# EAGLE design Interconnect_board_v1p7 (EAGLE 9.3.1)
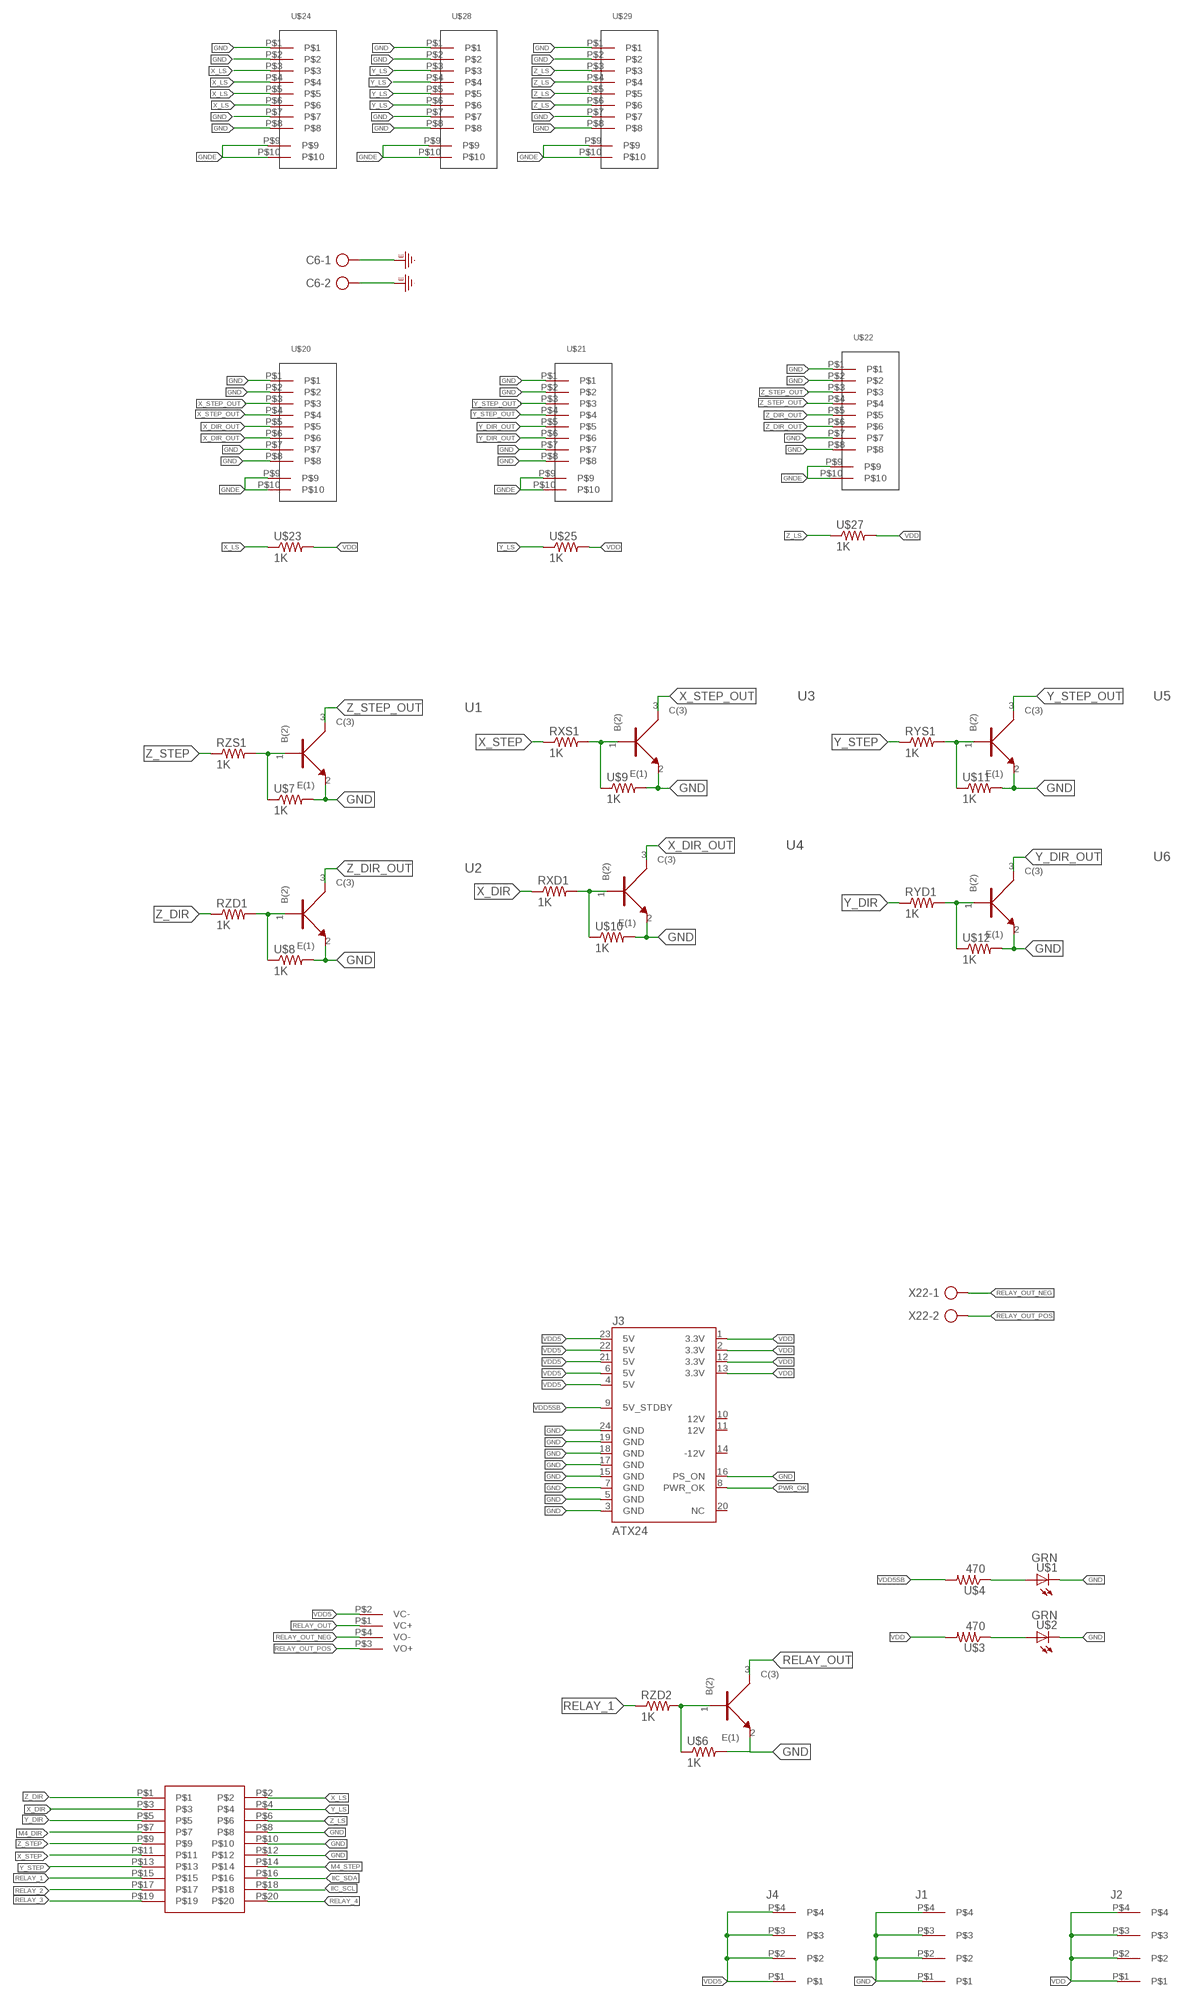
[diagram p0: schematic, sheet 1]

## Parts
C6  AK300/2  [AK300/2]
J1  3.81MM_1_X_4_RT_ANGLE_PLUG_HEADER  [1X4_3.81MM_PITCH]
J2  3.81MM_1_X_4_RT_ANGLE_PLUG_HEADER  [1X4_3.81MM_PITCH]
J3  ATX24  [ATX24_STRAIGHT]
J4  3.81MM_1_X_4_RT_ANGLE_PLUG_HEADER  [1X4_3.81MM_PITCH]
RXD1  R_0805_1K  [R_0805_1K]
RXS1  R_0805_1K  [R_0805_1K]
RYD1  R_0805_1K  [R_0805_1K]
RYS1  R_0805_1K  [R_0805_1K]
RZD1  R_0805_1K  [R_0805_1K]
RZD2  R_0805_1K  [R_0805_1K]
RZS1  R_0805_1K  [R_0805_1K]
U1  BC846BW  [SOT323]
U2  BC846BW  [SOT323]
U3  BC846BW  [SOT323]
U4  BC846BW  [SOT323]
U5  BC846BW  [SOT323]
U6  BC846BW  [SOT323]
U7  BC846BW  [SOT323]
U$1  LED_0805_GREEN  [LED_0805_GREEN]
U$2  LED_0805_GREEN  [LED_0805_GREEN]
U$3  R_0805_470  [R_0805_470]
U$4  R_0805_470  [R_0805_470]
U$5  RELAY_KYOTO_KF0604D  [RELAY_KYOTO_KF0604D]
U$6  R_0805_1K  [R_0805_1K]
U$7  R_0805_1K  [R_0805_1K]
U$8  R_0805_1K  [R_0805_1K]
U$9  R_0805_1K  [R_0805_1K]
U$10  R_0805_1K  [R_0805_1K]
U$11  R_0805_1K  [R_0805_1K]
U$12  R_0805_1K  [R_0805_1K]
U$20  RJ45_SMTRJ  [RJ45_SMT]
U$21  RJ45_SMTRJ  [RJ45_SMT]
U$22  RJ45_SMTRJ  [RJ45_SMT]
U$23  R_0805_1K  [R_0805_1K]
U$24  RJ45_SMTRJ  [RJ45_SMT]
U$25  R_0805_1K  [R_0805_1K]
U$26  2_X_10_HEADER_GENERIC  [2_X_10_.1_INCH]
U$27  R_0805_1K  [R_0805_1K]
U$28  RJ45_SMTRJ  [RJ45_SMT]
U$29  RJ45_SMTRJ  [RJ45_SMT]
X22  AK300/2  [AK300/2]

## Nets
GND: J1.P$1 J1.P$2 J1.P$3 J1.P$4 J3.3(GND) J3.5(GND) J3.7(GND) J3.15(GND) J3.16(PS_ON) J3.17(GND) J3.18(GND) J3.19(GND) J3.24(GND) U1.2(E(1)) U2.2(E(1)) U3.2(E(1)) U4.2(E(1)) U5.2(E(1)) U6.2(E(1)) U7.2(E(1)) U$1.C U$2.C U$6.2 U$7.2 U$8.2 U$9.2 U$10.2 U$11.2 U$12.2 U$20.P$1 U$20.P$2 U$20.P$7 U$20.P$8 U$21.P$1 U$21.P$2 U$21.P$7 U$21.P$8 U$22.P$1 U$22.P$2 U$22.P$7 U$22.P$8 U$24.P$1 U$24.P$2 U$24.P$7 U$24.P$8 U$26.P$8 U$26.P$10 U$26.P$12 U$28.P$1 U$28.P$2 U$28.P$7 U$28.P$8 U$29.P$1 U$29.P$2 U$29.P$7 U$29.P$8
GNDE: C6.1 C6.2 U$20.P$9 U$20.P$10 U$21.P$9 U$21.P$10 U$22.P$9 U$22.P$10 U$24.P$9 U$24.P$10 U$28.P$9 U$28.P$10 U$29.P$9 U$29.P$10
IIC_SCL: U$26.P$18
IIC_SDA: U$26.P$16
M4_DIR: U$26.P$7
M4_STEP: U$26.P$14
N$1: RXS1.2 U3.1(B(2)) U$9.1
N$3: RZD1.2 U2.1(B(2)) U$8.1
N$4: U$1.A U$4.1
N$5: U$2.A U$3.1
N$7: RZS1.2 U1.1(B(2)) U$7.1
N$8: RZD2.2 U7.1(B(2)) U$6.1
N$9: RYS1.2 U5.1(B(2)) U$11.1
N$15: RXD1.2 U4.1(B(2)) U$10.1
N$18: RYD1.2 U6.1(B(2)) U$12.1
PWR_OK: J3.8(PWR_OK)
RELAY_1: RZD2.1 U$26.P$15
RELAY_2: U$26.P$17
RELAY_3: U$26.P$19
RELAY_4: U$26.P$20
RELAY_OUT: U7.3(C(3)) U$5.P$1(VC+)
RELAY_OUT_NEG: U$5.P$4(VO-) X22.1
RELAY_OUT_POS: U$5.P$3(VO+) X22.2
VDD: J2.P$1 J2.P$2 J2.P$3 J2.P$4 J3.1(3.3V) J3.2(3.3V) J3.12(3.3V) J3.13(3.3V) U$3.2 U$23.2 U$25.2 U$27.2
VDD5: J3.4(5V) J3.6(5V) J3.21(5V) J3.22(5V) J3.23(5V) J4.P$1 J4.P$2 J4.P$3 J4.P$4 U$5.P$2(VC-)
VDD5SB: J3.9(5V_STDBY) U$4.2
X_DIR: RXD1.1 U$26.P$3
X_DIR_OUT: U4.3(C(3)) U$20.P$5 U$20.P$6
X_LS: U$23.1 U$24.P$3 U$24.P$4 U$24.P$5 U$24.P$6 U$26.P$2
X_STEP: RXS1.1 U$26.P$11
X_STEP_OUT: U3.3(C(3)) U$20.P$3 U$20.P$4
Y_DIR: RYD1.1 U$26.P$5
Y_DIR_OUT: U6.3(C(3)) U$21.P$5 U$21.P$6
Y_LS: U$25.1 U$26.P$4 U$28.P$3 U$28.P$4 U$28.P$5 U$28.P$6
Y_STEP: RYS1.1 U$26.P$13
Y_STEP_OUT: U5.3(C(3)) U$21.P$3 U$21.P$4
Z_DIR: RZD1.1 U$26.P$1
Z_DIR_OUT: U2.3(C(3)) U$22.P$5 U$22.P$6
Z_LS: U$26.P$6 U$27.1 U$29.P$3 U$29.P$4 U$29.P$5 U$29.P$6
Z_STEP: RZS1.1 U$26.P$9
Z_STEP_OUT: U1.3(C(3)) U$22.P$3 U$22.P$4
Unconnected: J3.10(12V) J3.11(12V) J3.14(-12V) J3.20(NC)

## Library data of the parts
C6 X22 = 3D_MIG_Controller:AK300/2: CONNECTOR; OC_FARNELL: unknown; OC_NEWARK: unknown
J1 J2 J4 = 3D_MIG_Controller:3.81MM_1_X_4_RT_ANGLE_PLUG_HEADER
J3 = 3D_MIG_Controller:ATX24: ATX24 Pin Power Supply Connector - Right Angle PTH Mount This is a good connector for connecting a computer power supply to a PCB. It's massive, but provides many amps of power at 5V and 12V. SparkFun Products: SparkFun Benchtop Power Board Kit <https://www.sparkfun.com/products/12867> SparkFun Power Driver Shield Kit <https://www.sparkfun.com/products/10618>
RXD1 RXS1 RYD1 RYS1 RZD1 RZD2 RZS1 U$6-U$12 U$23 U$25 U$27 = 3D_MIG_Controller:R_0805_1K
U1-U7 = 3D_MIG_Controller:BC846BW; MANUFACTURER_PART_NUMBER: BC846BW; VENDOR: Nexperia
U$1 U$2 = 3D_MIG_Controller:LED_0805_GREEN
U$3 U$4 = 3D_MIG_Controller:R_0805_470
U$5 = 3D_MIG_Controller:RELAY_KYOTO_KF0604D
U$20-U$22 U$24 U$28 U$29 = 3D_MIG_Controller:RJ45_SMT
U$26 = 3D_MIG_Controller:2_X_10_HEADER_GENERIC

## Board
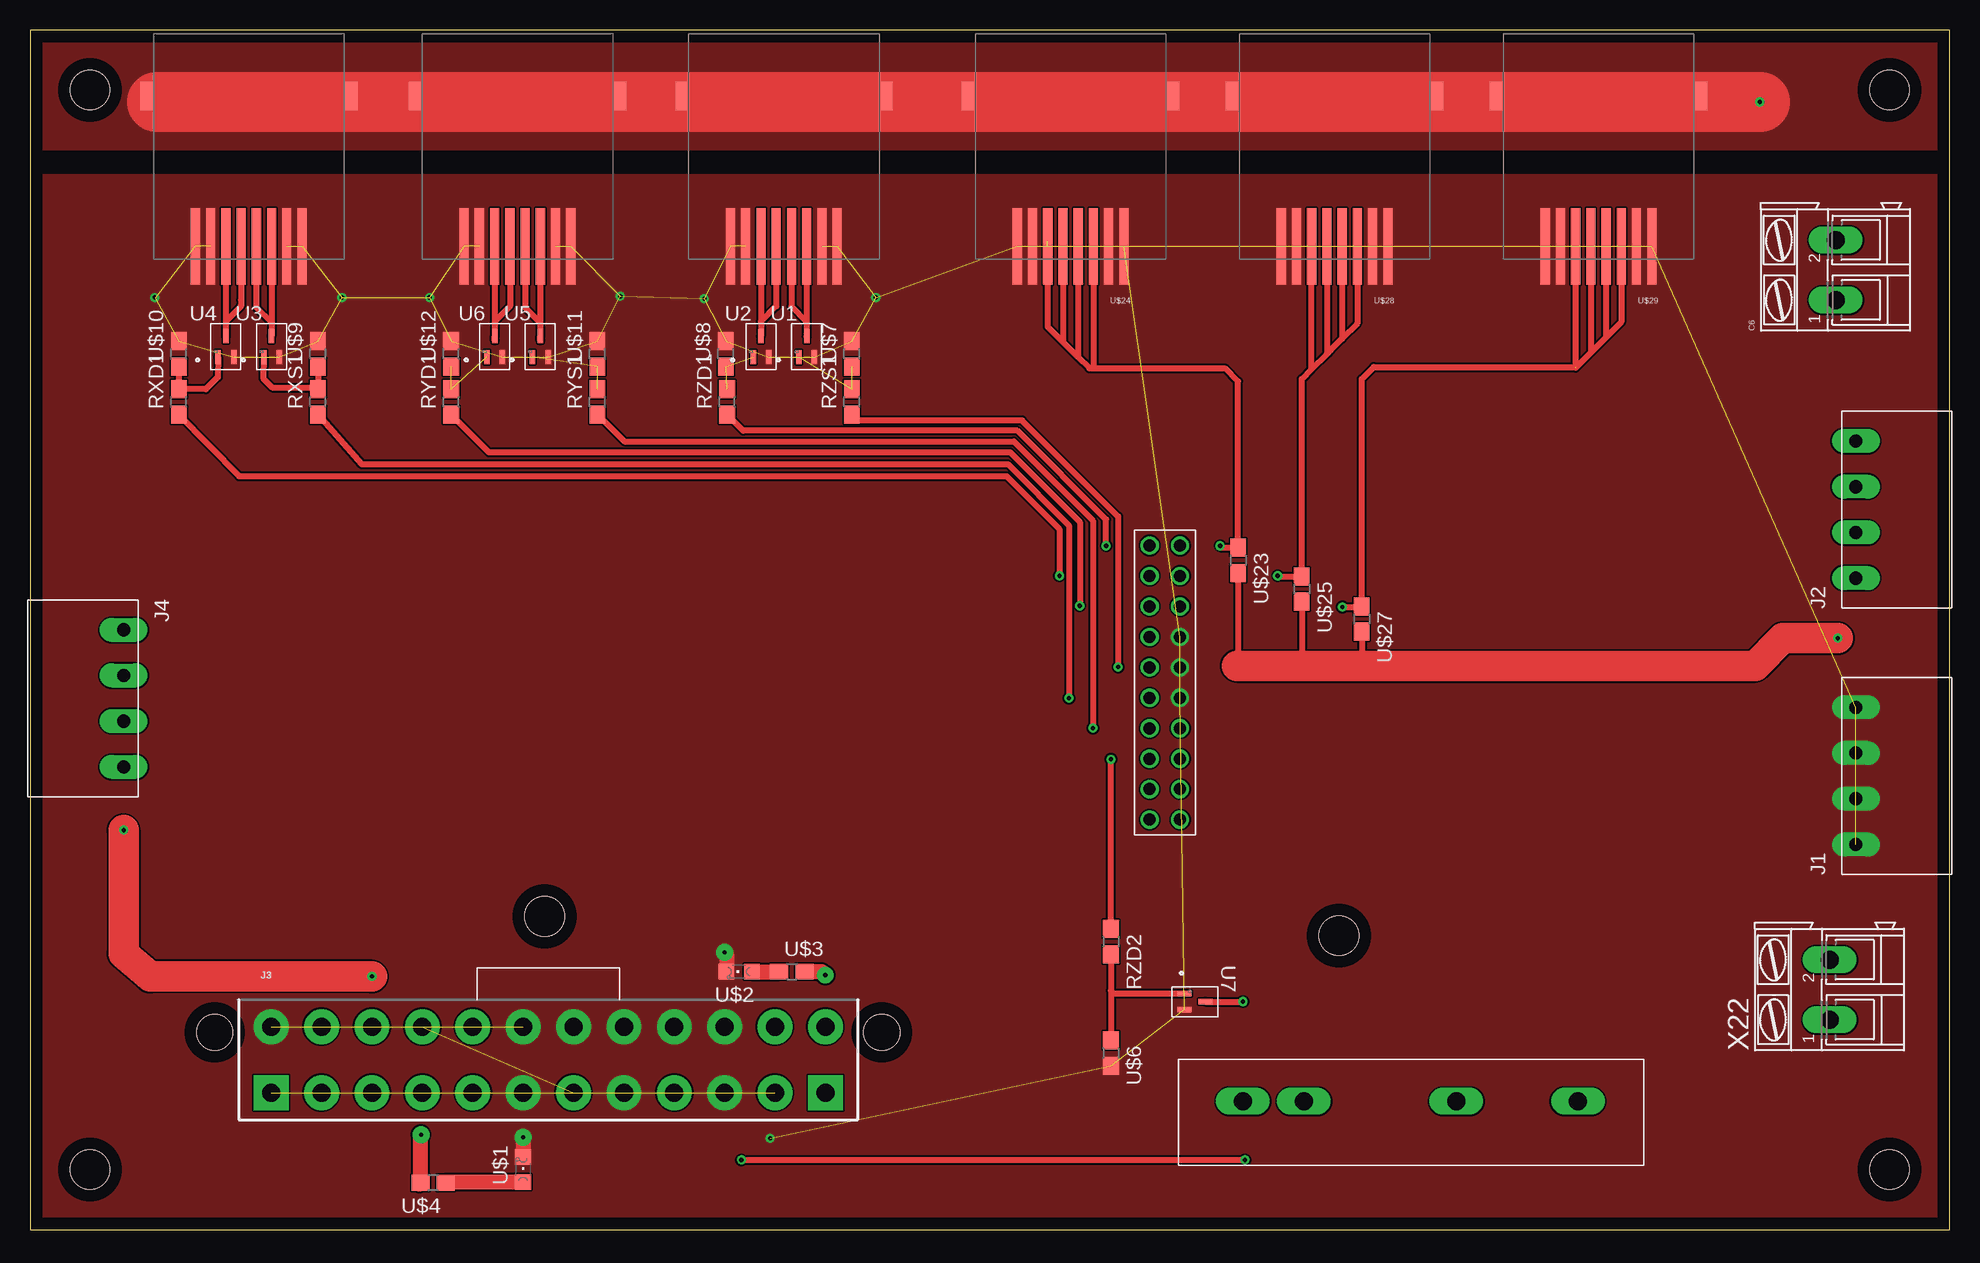
[diagram p1: board, top side]
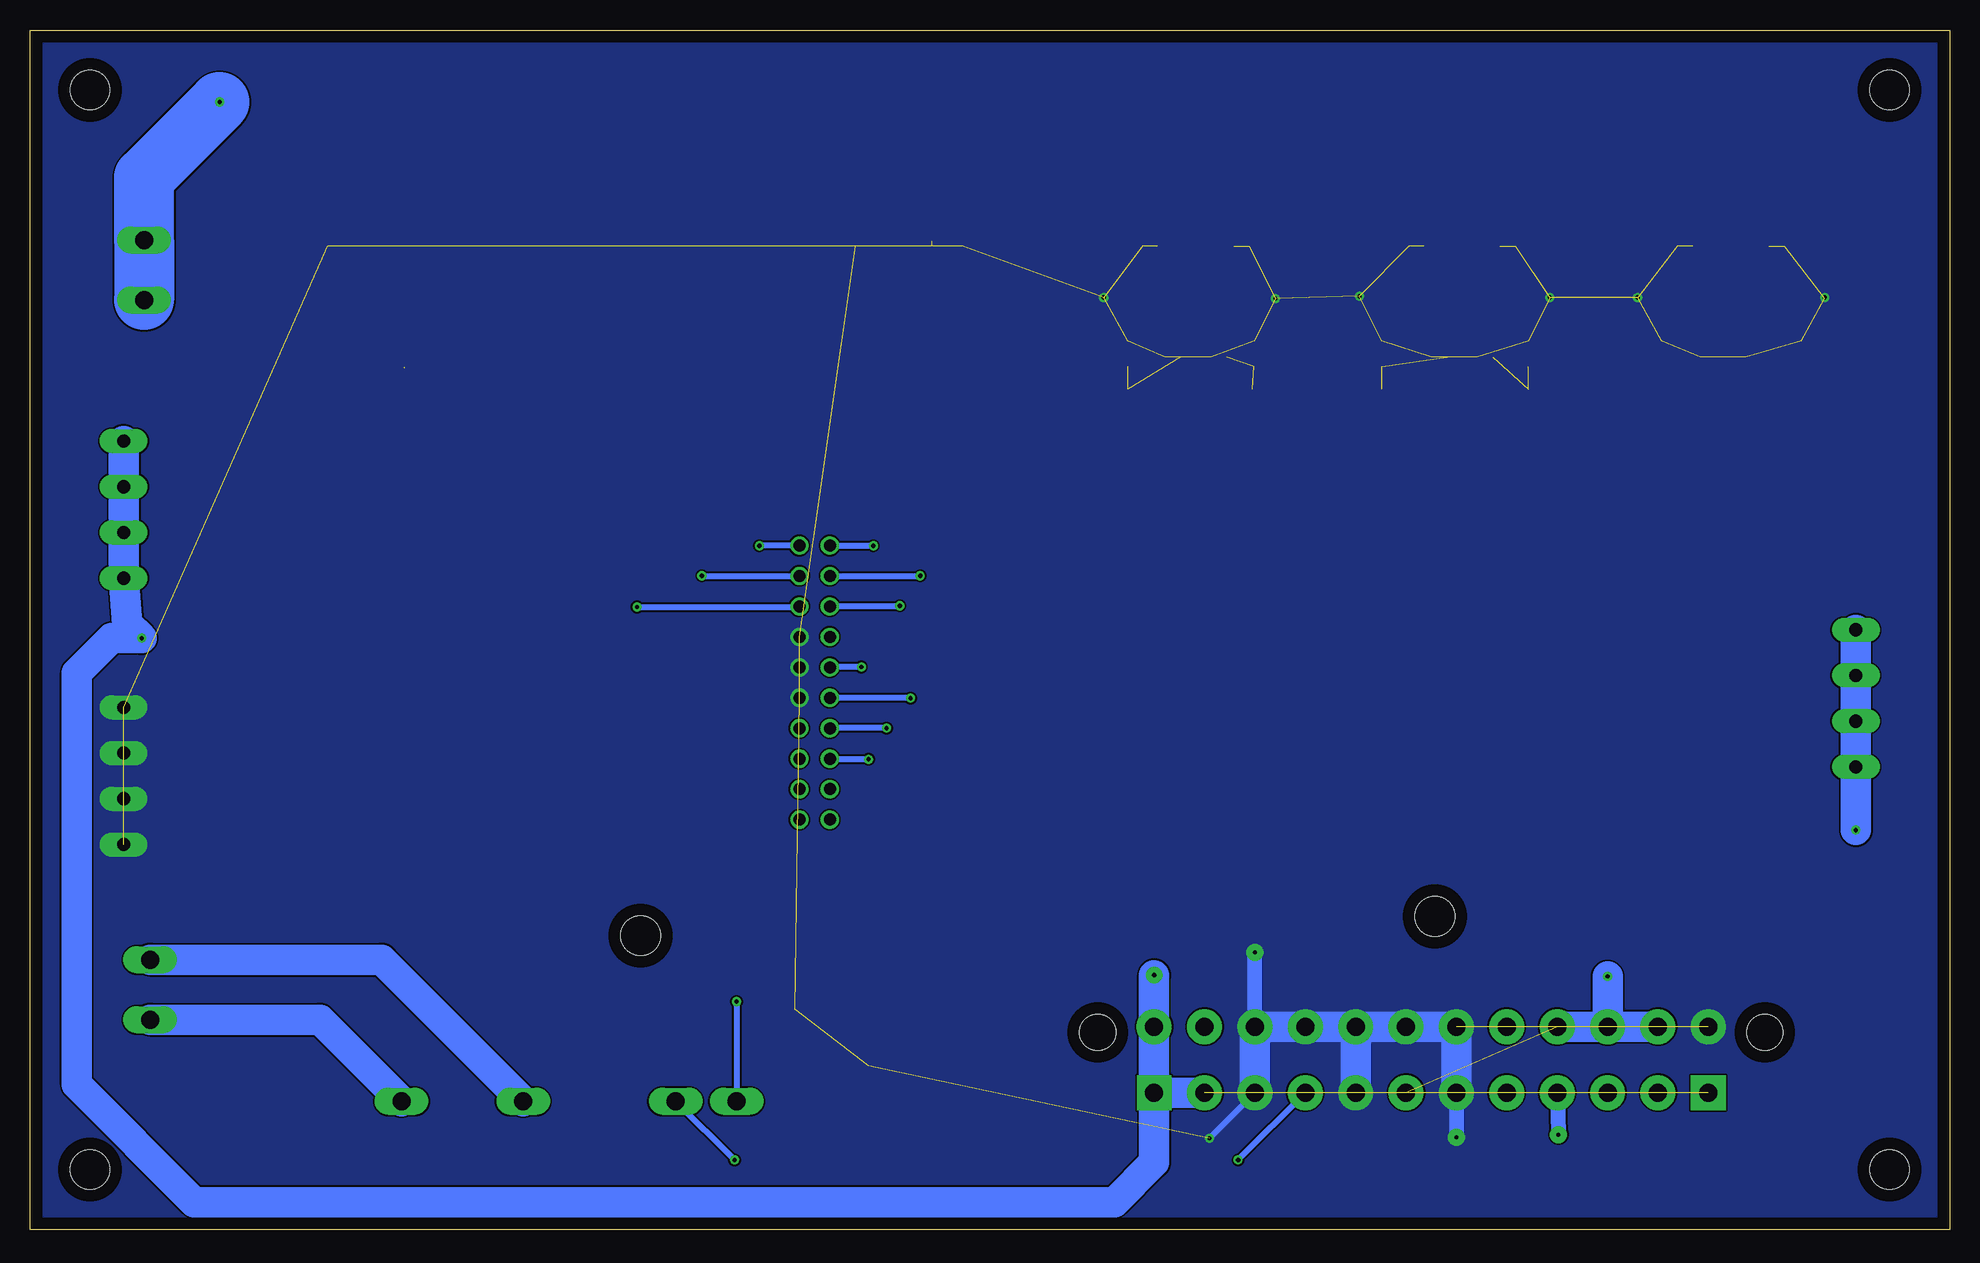
[diagram p2: board, bottom side, seen from below]

Size 160 x 100 mm. Coordinates in mm from the lower left corner, seen from the top.
Outline: 0,0 160,0 160,100 0,100 0,0
Copper layers (1*16): Top 0.035mm / dielectric 1.5mm / Bottom 0.035mm
Design rules "default": minimum track width 6mil, minimum drill 0.35mm, track to track 6mil, track to pad 6mil, pad to pad 6mil, via to via 6mil, smd to smd 6mil, copper to edge 40mil, drill to drill 6mil, minimum pad ring 10mil, minimum via ring 8mil, stop-mask expansion 4mil, vias tented up to drill 0mil, thermal gap 10mil
Holes 3.3 mm at 5,95 5,5 155,5 155,95 42.9,26.1 109.1,24.5

### Footprints (pad centres in the part's own frame; a part is rotated, then mirrored left to right if it is on the bottom)
AK300/2 = drill 1.5 long: 1 -2.515,0; 2 2.489,0
1X4_3.81MM_PITCH = drill 1.1 pad 2 long: P$1 0,0; P$2 3.81,0; P$3 7.62,0; P$4 11.43,0
ATX24_STRAIGHT = drill 1.5 pad 2.9 square: 1 23.1,-5.5; 12 -23.1,-5.5 | drill 1.5 pad 2.9: 2 18.9,-5.5; 3 14.7,-5.5; 4 10.5,-5.5; 5 6.3,-5.5; 6 2.1,-5.5; 7 -2.1,-5.5; 8 -6.3,-5.5; 9 -10.5,-5.5; 10 -14.7,-5.5; 11 -18.9,-5.5; 13 23.1,0; 14 18.9,0; 15 14.7,0; 16 10.5,0; 17 6.3,0; 18 2.1,0; 19 -2.1,0; 20 -6.3,0; 21 -10.5,0; 22 -14.7,0; 23 -18.9,0; 24 -23.1,0 | hole 3: -27.8,-0.46; 27.8,-0.46
R_0805_1K = smd 1.5 x 1.3: 1 -1.052,0; 2 1.052,0
SOT323 = smd 0.457 x 1.168: 1 -0.65,-0.876; 2 0.65,-0.876; 3 0,0.876
LED_0805_GREEN = smd 1.3 x 1.3: A 0,-1.05; C 0,1.05
R_0805_470 = smd 1.5 x 1.3: 1 -1.052,0; 2 1.052,0
RELAY_KYOTO_KF0604D = drill 1.5 long: P$1 0,0; P$2 -5.08,0; P$3 -17.78,0; P$4 -27.94,0
RJ45_SMT = smd 0.76 x 6.35: P$1 -3.18,8.94; P$2 -1.91,8.94; P$3 -0.64,8.94; P$4 0.63,8.94; P$5 1.9,8.94; P$6 3.17,8.94; P$7 4.44,8.94; P$8 5.71,8.94 | smd 1.1 x 2.4: P$9 -7.25,-3.6; P$10 9.75,-3.6
2_X_10_.1_INCH = drill 1: P$1 -11.43,-1.27; P$2 -11.43,1.27; P$3 -8.89,-1.27; P$4 -8.89,1.27; P$5 -6.35,-1.27; P$6 -6.35,1.27; P$7 -3.81,-1.27; P$8 -3.81,1.27; P$9 -1.27,-1.27; P$10 -1.27,1.27; P$11 1.27,-1.27; P$12 1.27,1.27; P$13 3.81,-1.27; P$14 3.81,1.27; P$15 6.35,-1.27; P$16 6.35,1.27; P$17 8.89,-1.27; P$18 8.89,1.27; P$19 11.43,-1.27; P$20 11.43,1.27

### Placement (x,y rotation side)
C6  150.5,80 90 top
J1  152.2,32.1 90 top
J2  152.2,54.3 90 top
J3  43.2,16.9 0 top
J4  7.8,50 270 top
RXD1  12.4,69 90 top
RXS1  24,69 90 top
RYD1  35.1,69 90 top
RYS1  47.3,69 90 top
RZD1  58.1,69 90 top
RZD2  90.1,24 270 top
RZS1  68.5,69 90 top
U1  64.74,73.6 0 top
U2  60.93,73.6 0 top
U3  20.14,73.6 0 top
U4  16.33,73.6 0 top
U5  42.54,73.6 0 top
U6  38.73,73.6 0 top
U7  97.1,19 270 top
U$1  41.1,5 0 top
U$2  59.1,21.5 90 top
U$3  63.5,21.5 0 top
U$4  33.6,3.9 180 top
U$5  101.1,10.7 180 top
U$6  90.1,14.7 270 top
U$7  68.5,73 90 top
U$8  58,73 90 top
U$9  24,73 90 top
U$10  12.4,73 90 top
U$11  47.3,73 90 top
U$12  35.1,73 90 top
U$20  19.5,90.9 180 top
U$21  41.9,90.9 180 top
U$22  64.1,90.9 180 top
U$23  100.7,55.8 270 top
U$24  88,90.9 180 top
U$25  106,53.4 270 top
U$26  94.6,45.6 270 top
U$27  111,50.9 270 top
U$28  110,90.9 180 top
U$29  132,90.9 180 top
X22  150,20 90 top

### Tracks (layer width: path | path; a pad name or v marks a point on that pad's centre or on a via)
GND  (via drill 0.35, 0.35 pad 1.4)  (52 unrouted)
  Top 0.508: 10.45,77.65 v10.4,77.7
  Top 1.27: v41.1,7.7 U$1.C | v57.9,23.1 58.05,22.95 U$2.C
  Bottom 0.508: v61.7,7.6 J3.3
  Bottom 1.27: J3.7 v41.1,7.7 | J3.15 v57.9,23.1
  Bottom 2.54: J3.3 J3.15 J3.16 J3.17 | J3.5 J3.17 | J3.7 J3.19 J3.18 J3.17
  other vias: 26,77.7 33.3,77.7 49.2,77.8 56.2,77.6 70.5,77.7
  pour Bottom (no thermals): 0,100 160,100 160,0 0,0
  pour Top (no thermals): 0,88 160,88 160,0 0,0
GNDE  (via drill 0.35)
  Top 5: v144.2,94 10.6,94
  Bottom 5: C6.1 C6.2 150.5,87.7 v144.2,94
  pour Top (no thermals): 0,100 0,90 160,90 160,100
N$1
  Top 0.508: RXS1.2 24,70.2 | U3.1 19.45,70.95 20.2,70.2 24,70.2 | U$9.1 24,70.2
N$3  (2 unrouted)
N$4
  Top 1.27: U$1.A 34.7,3.95 U$4.1
N$5
  Top 1.27: U$2.A U$3.1
N$7  (2 unrouted)
N$8
  Top 0.508: RZD2.2 90.1,19.9 | 90.1,19.9 U$6.1 | U7.1 90.35,19.65 90.1,19.9
N$9  (2 unrouted)
N$15
  Top 0.508: U4.1 15.65,71.05 14.65,70.05 RXD1.2 U$10.1
N$18  (2 unrouted)
RELAY_1  (via drill 0.35)
  Top 0.508: RZD2.1 v90.1,39.2
  Bottom 0.508: U$26.P$15 90.15,39.25 v90.1,39.2
RELAY_OUT  (via drill 0.35)
  Top 0.508: U7.3 v101.1,19
  Bottom 0.508: U$5.P$1 101.1,14 101.1,15.6 v101.1,19
RELAY_OUT_NEG
  Bottom 2.54: X22.1 135.82,17.48 U$5.P$4
RELAY_OUT_POS
  Bottom 2.54: X22.2 130.67,22.49 U$5.P$3
VDD  (via drill 0.35, 0.35 pad 1.4)  (1 unrouted)
  Top 0.508: 100.6,47 100.7,47.1 U$23.2 | 106.1,47 106,47.1 U$25.2 | U$27.2 111,47
  Top 1.27: v66.3,21.2 66,21.5 U$3.2
  Top 2.54: 100.6,47 106.1,47 111,47 143.8,47 146.1,49.3 v150.7,49.3
  Bottom 2.54: J3.1 J3.13 v66.3,21.2 | J3.2 J3.1 | J3.1 66.3,5.6 69.61,2.29 146.3,2.29 156.1,12.09 156.1,46.4 153.2,49.3 v150.7,49.3 151.9,50.5 J2.P$1 J2.P$2 J2.P$3 J2.P$4
VDD5  (via drill 0.35)  (2 unrouted)
  Top 0.508: v59.3,5.8 v101.28,5.8
  Top 2.54: v28.5,21.1 10,21.1 7.8,23 v7.8,33.3
  Bottom 0.508: J3.4 v59.3,5.8 | v101.28,5.8 U$5.P$2
  Bottom 2.54: J3.21 J3.22 | J3.23 J3.22 | J3.22 v28.5,21.1 | v7.8,33.3 J4.P$4 J4.P$3 J4.P$2 J4.P$1
VDD5SB  (via drill 0.35 pad 1.4)
  Top 1.27: 32.45,3.8 U$4.2 32.55,7.85 v32.6,7.9
  Bottom 1.27: J3.9 v32.6,7.9
X_DIR  (via drill 0.35)
  Top 0.508: RXD1.1 17.43,62.8 81.4,62.8 85.8,58.4 v85.8,54.5
  Bottom 0.508: U$26.P$3 v85.8,54.5
X_DIR_OUT
  Top 0.508: 16.3,81.23 U$20.P$6 16.33,75.7 | U$20.P$5 17.6,77.5 17.6,77.1 17.6,76.97 16.33,75.7 | 16.33,75.7 16.33,74.51 U4.3
X_LS  (via drill 0.35)  (1 unrouted)
  Top 0.508: v99.2,57 99.35,56.85 U$23.1 100.7,70.7 99.6,71.8 88.8,71.8 | 88.8,71.8 88.3,71.8 87.37,72.73 | 84.8,82.4 84.7,82.5 | U$24.P$6 84.83,75.27 86.1,74 | U$24.P$5 86.1,74 | 86.1,74 87.37,72.73 | U$24.P$4 87.37,72.73 | U$24.P$3 88.64,71.96 88.8,71.8
  Bottom 0.508: v99.2,57 99.16,57.04 99.15,57.03 U$26.P$2
X_STEP  (via drill 0.35)
  Top 0.508: RXS1.1 27.67,63.8 81.5,63.8 86.6,58.7 v86.6,44.3
  Bottom 0.508: 86.64,44.26 v86.6,44.3 93.3,44.3 U$26.P$11
X_STEP_OUT
  Top 0.508: U$20.P$4 18.87,76.87 20.14,75.6 | U3.3 20.14,74.52 20.14,75.6 | U$20.P$3 20.14,75.6
Y_DIR  (via drill 0.35)
  Top 0.508: RYD1.1 38.25,64.8 81.7,64.8 87.5,59 v87.5,52
  Bottom 0.508: U$26.P$5 93.28,52 v87.5,52
Y_DIR_OUT
  Top 0.508: U$21.P$6 38.73,75.7 | 38.73,75.7 U6.3 38.73,74.11 | U$21.P$5 40,76.97 38.73,75.7
Y_LS  (via drill 0.35)
  Top 0.508: v104,54.5 104.05,54.45 U$25.1 106,70.9 106.83,71.73 | 106.83,71.73 U$28.P$6 | U$28.P$5 108.1,73 | 108.1,73 106.83,71.73 | U$28.P$4 109.37,74.27 | 109.37,74.27 108.4,73.3 108.1,73 | U$28.P$3 110.64,75.54 109.37,74.27
  Bottom 0.508: v104,54.5 U$26.P$4
Y_STEP  (via drill 0.35)
  Top 0.508: RYS1.1 49.55,65.7 82,65.7 88.6,59.1 v88.6,41.8
  Bottom 0.508: v88.6,41.8 U$26.P$13
Y_STEP_OUT
  Top 0.508: U$21.P$3 42.54,75.6 | 42.54,75.6 U5.3 42.54,74.12 | U$21.P$4 41.27,76.87 42.54,75.6
Z_DIR  (via drill 0.35)
  Top 0.508: RZD1.1 59.45,66.6 82.3,66.6 89.7,59.2 v89.7,57
  Bottom 0.508: v89.7,57 93.3,57 U$26.P$1
Z_DIR_OUT
  Top 0.508: U$22.P$6 60.93,75.7 | 60.93,75.7 U2.3 | U$22.P$5 62.2,76.97 60.93,75.7
Z_LS  (via drill 0.35)  (1 unrouted)
  Top 0.508: v109.4,51.9 110.95,51.9 U$27.1 111,70.9 112,71.9 128.83,71.9 U$29.P$6 | 128.83,71.83 130.1,73.1 | U$29.P$3 132.64,75.64 131.45,74.45 | 131.45,74.45 130.1,73.1 | U$29.P$5 130.1,73.1 | U$29.P$4 131.37,74.53 131.45,74.45
  Bottom 0.508: 109.34,51.96 v109.4,51.9 95.92,51.9 U$26.P$6
Z_STEP  (via drill 0.35)
  Top 0.508: v90.7,46.9 90.7,59.45 82.7,67.45 69,67.45 RZS1.1
  Bottom 0.508: v90.7,46.9 93.3,46.9 U$26.P$9
Z_STEP_OUT
  Top 0.508: U$22.P$3 64.74,75.7 | 64.74,75.7 U1.3 64.74,74.42 | U$22.P$4 63.47,76.97 64.74,75.7